# Altium project RA6M1_1.PrjPcb
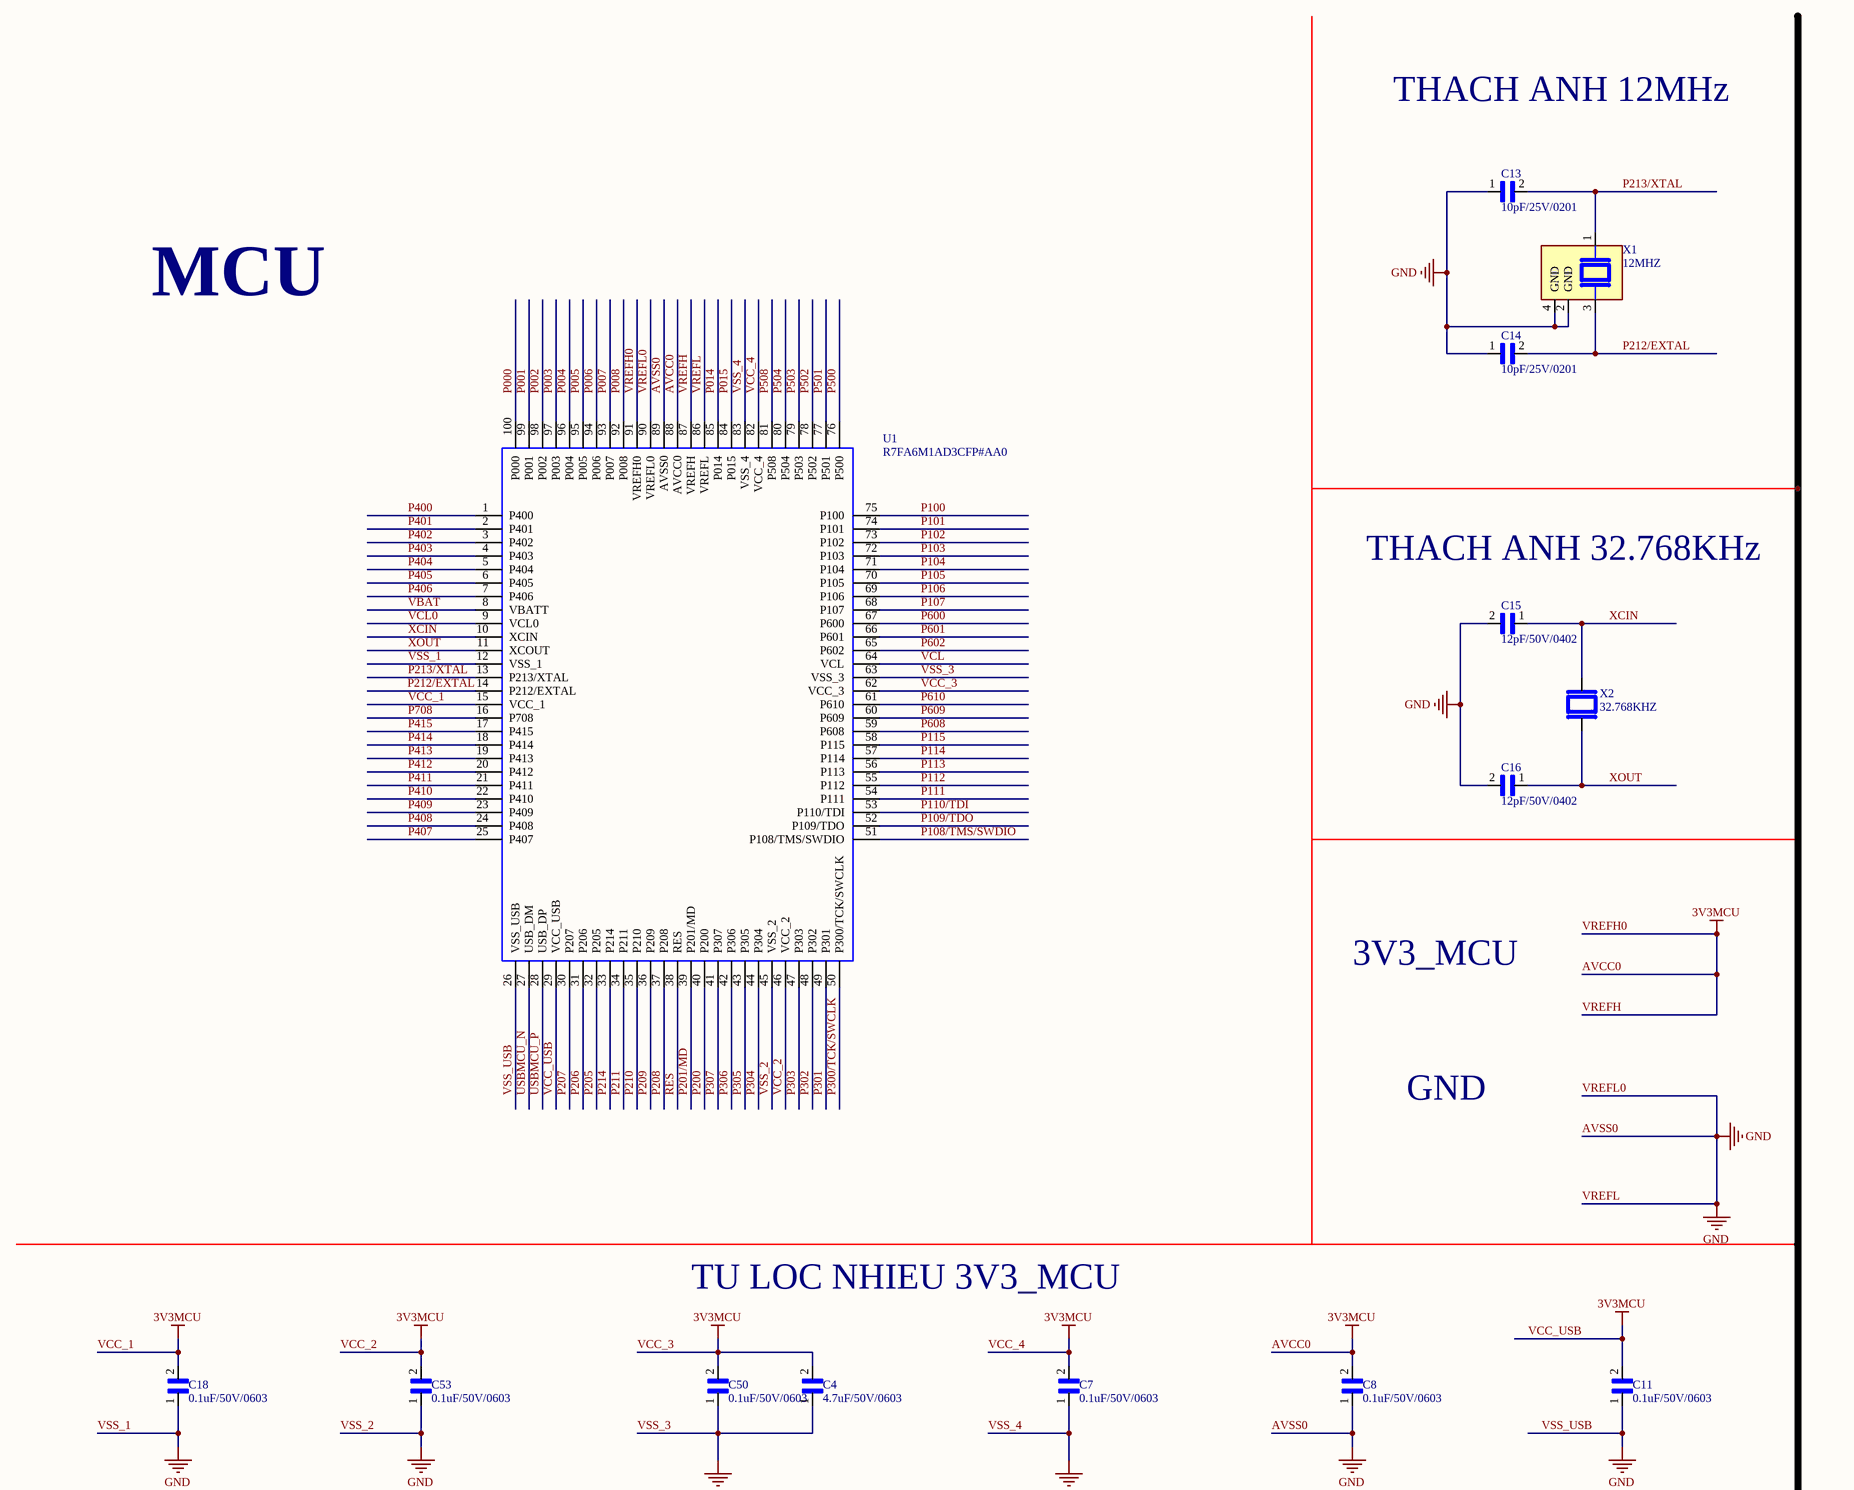
[diagram p0: RA6M1.SchDoc, top left]
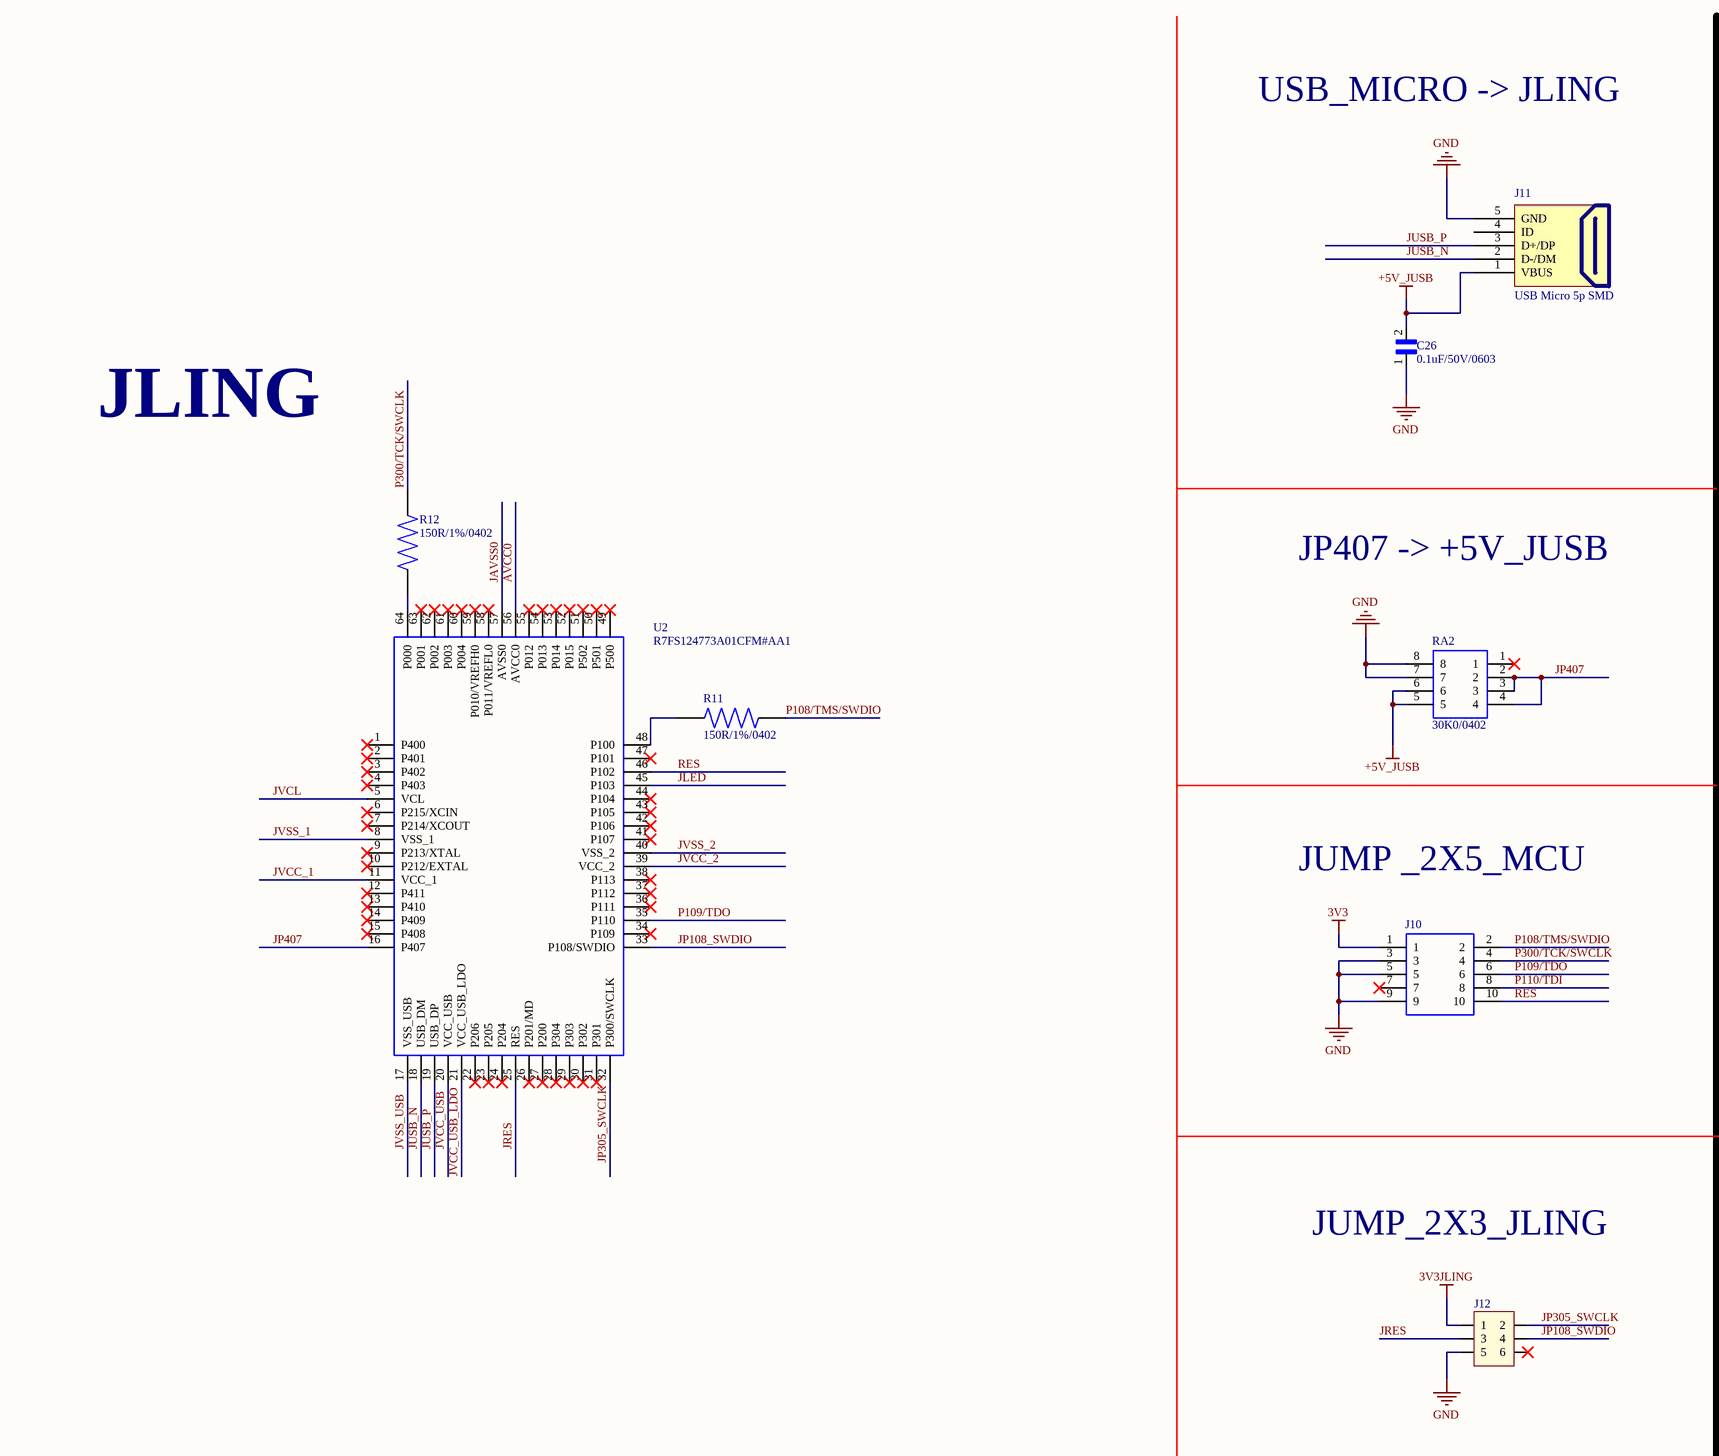
[diagram p1: RA6M1.SchDoc, top middle]
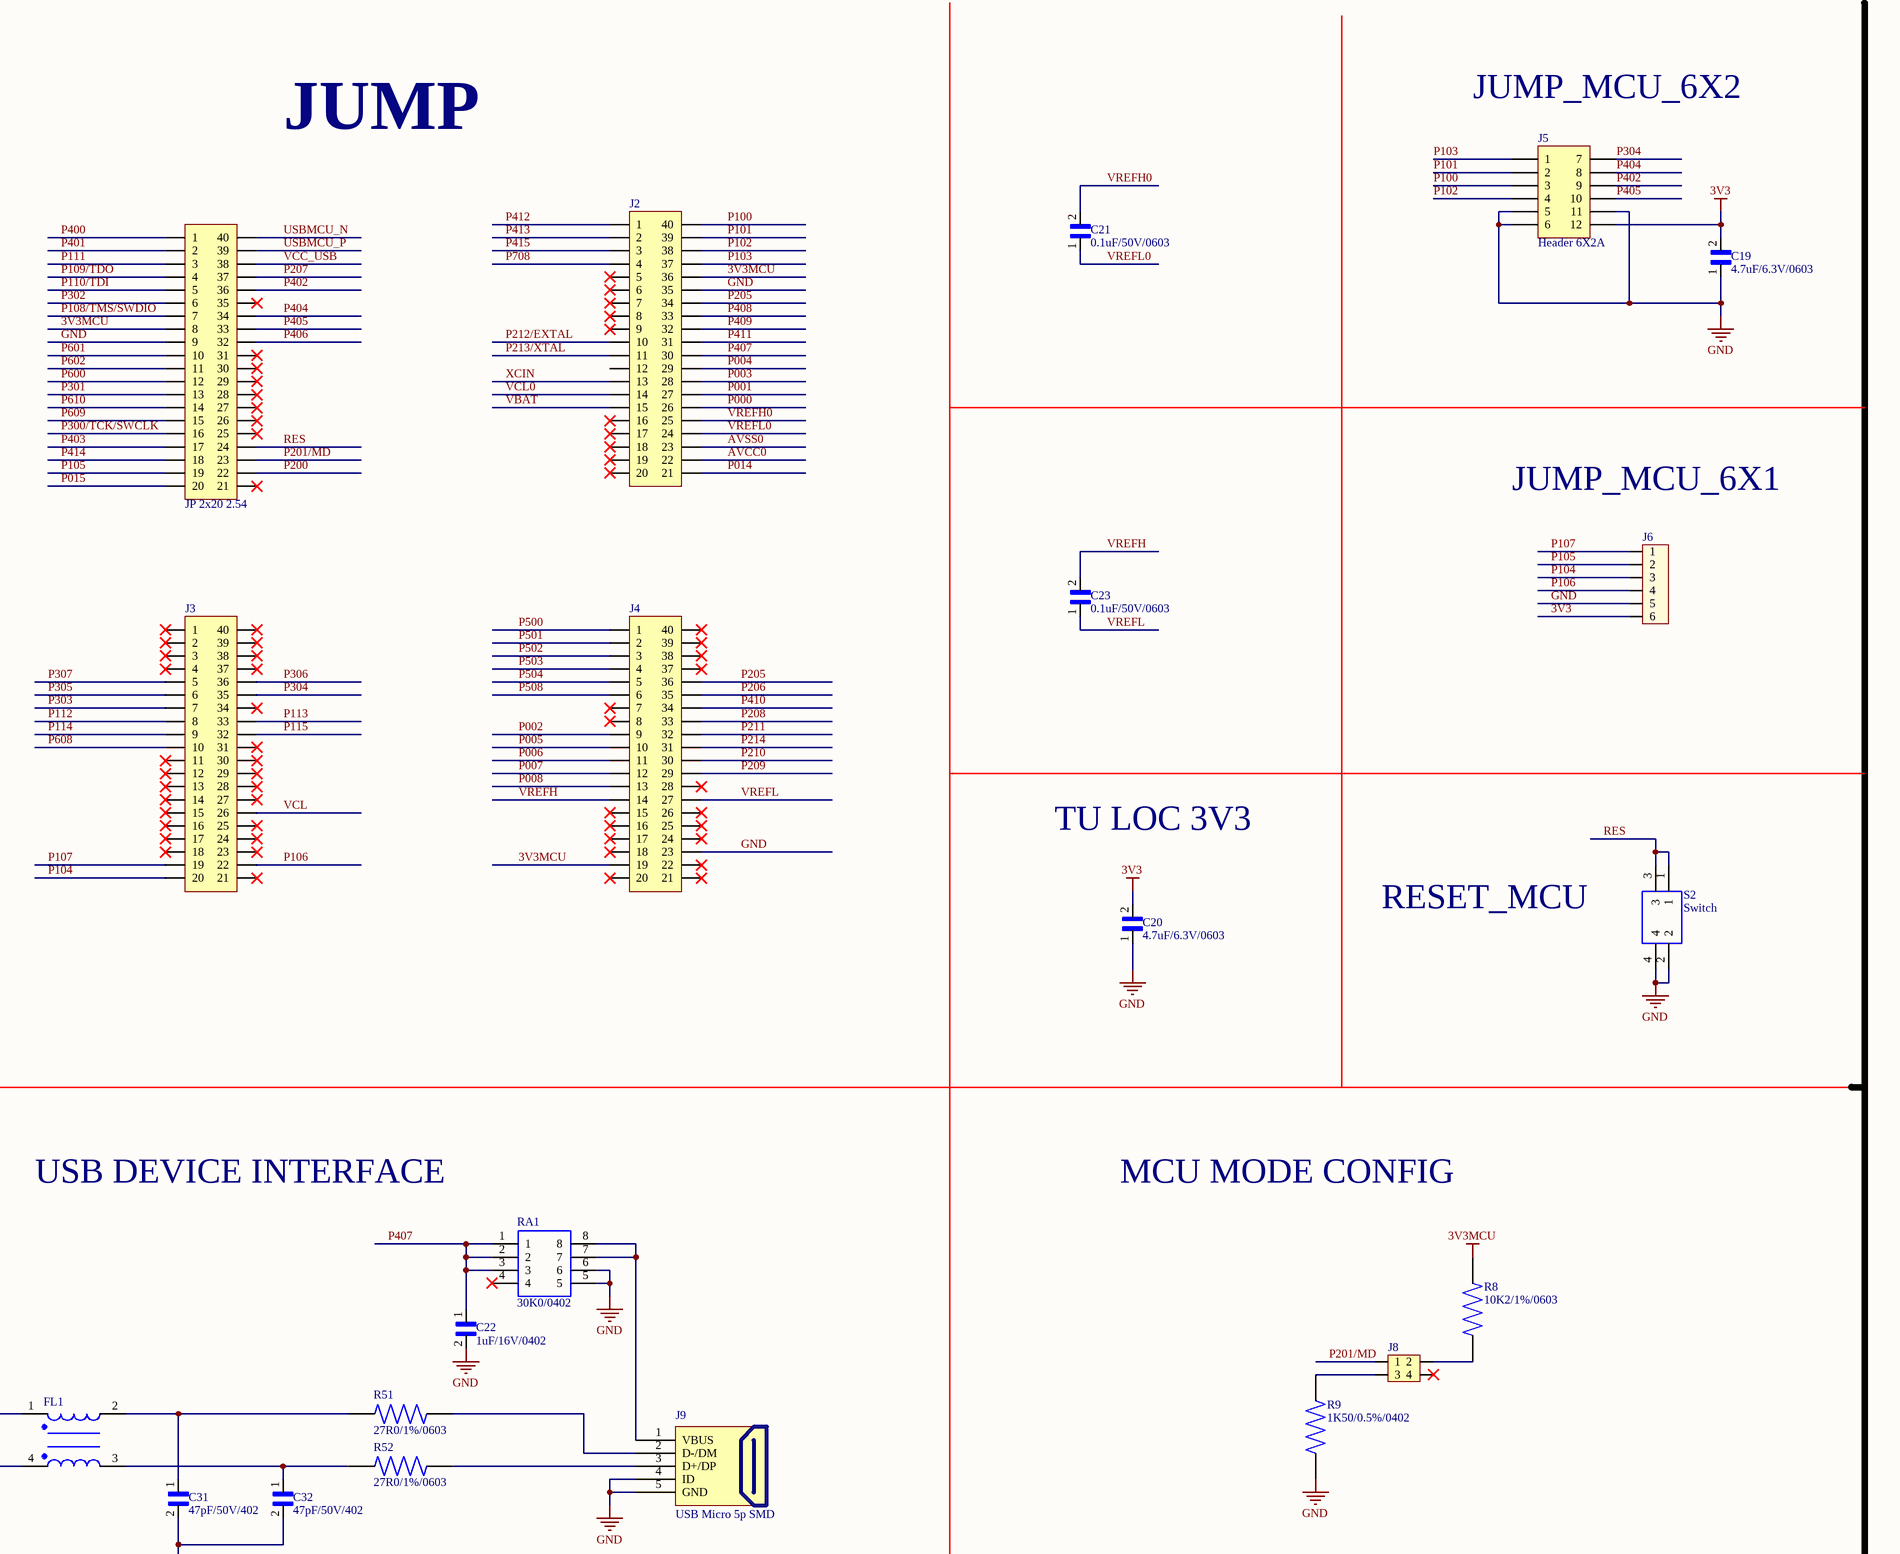
[diagram p2: RA6M1.SchDoc, top right]
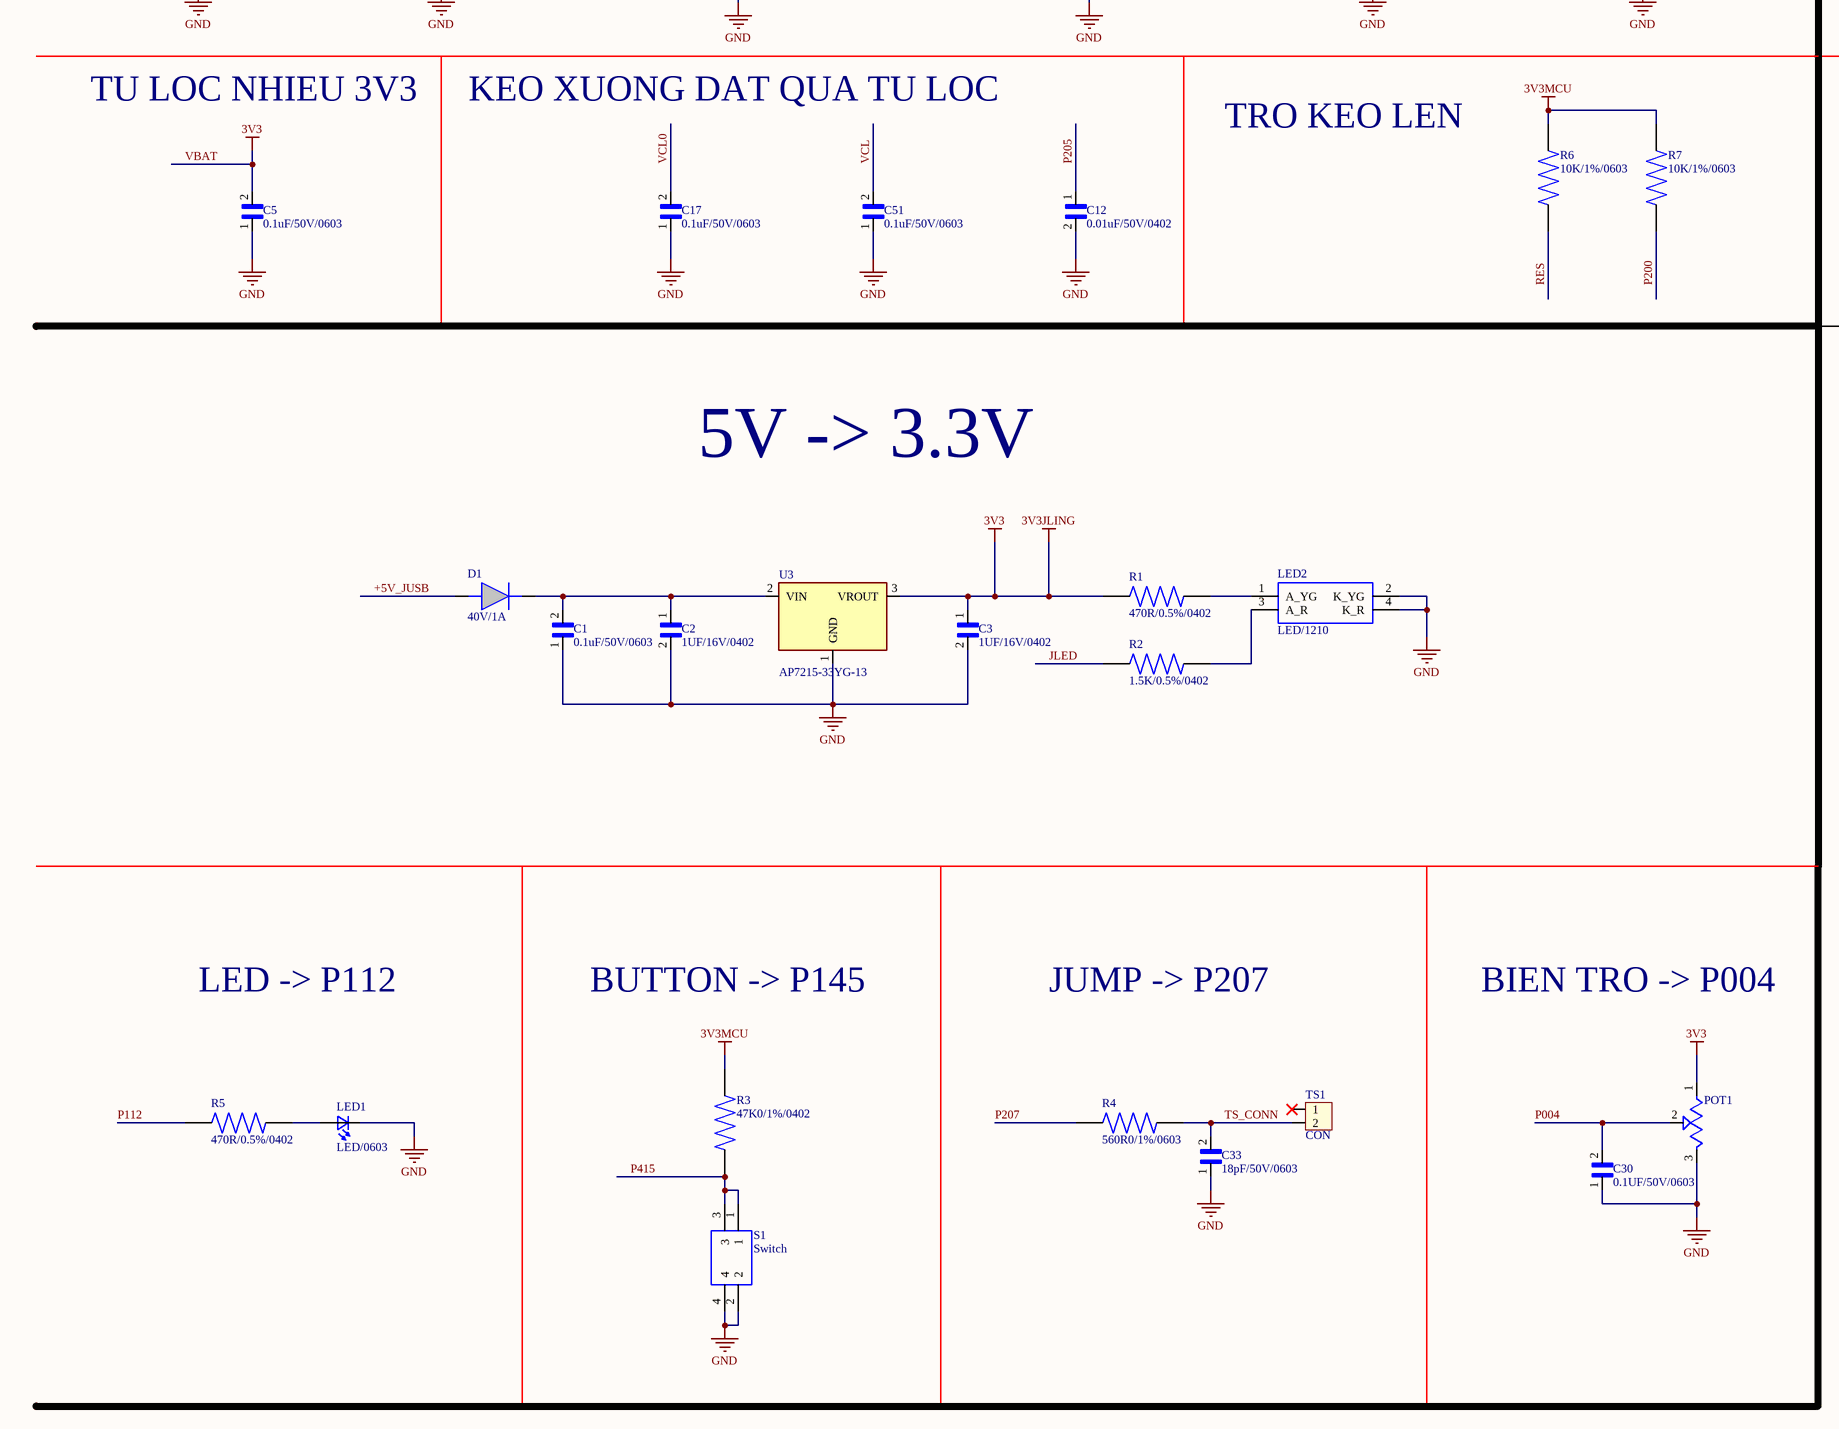
[diagram p3: RA6M1.SchDoc, bottom left]
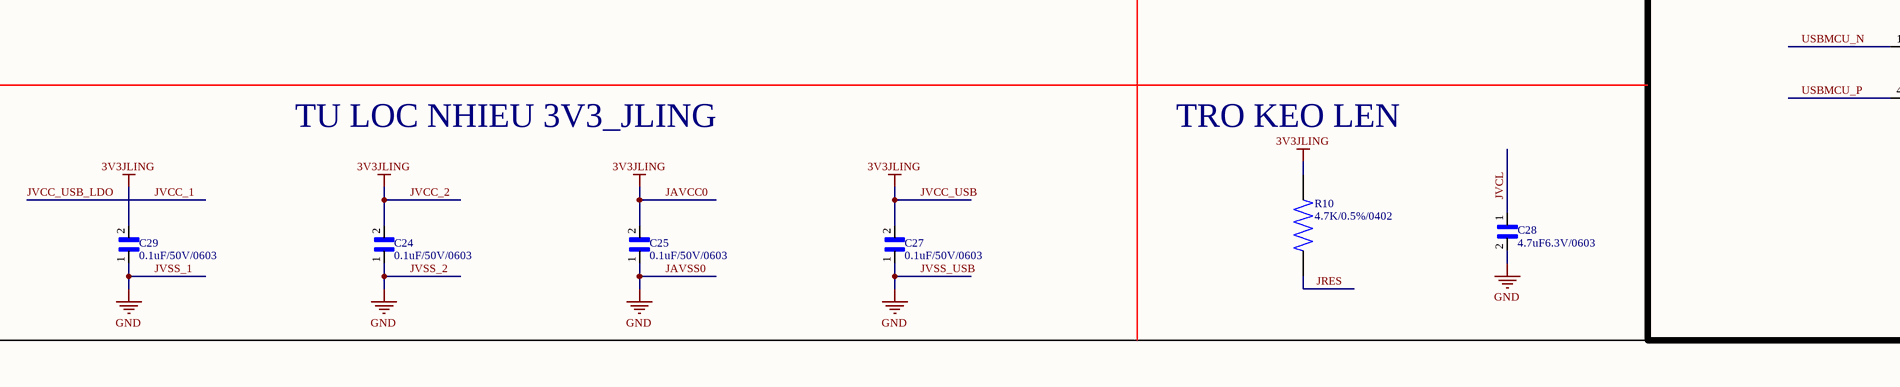
[diagram p4: RA6M1.SchDoc, bottom middle]
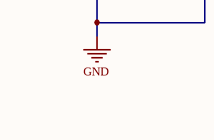
[diagram p5: RA6M1.SchDoc, bottom right]
1 sheet, 73 parts. Net scope: global (net labels, ports and power ports of the same name join across sheets).
Board file: RA6M1.PcbDoc

## Sheet RA6M1.SchDoc
size A0; SheetNumber: 1; SheetTotal: 1

### Parts
C1  0.1uF/50V/0603  [CAPC1608X90N]
C2  1UF/16V/0402  [CAPC1005X55N]
C3  1UF/16V/0402  [CAPC1005X55N]
C4  4.7uF/50V/0603  [CAPC1608X90N]
C5  0.1uF/50V/0603  [CAPC1608X90N]
C7  0.1uF/50V/0603  [CAPC1608X90N]
C8  0.1uF/50V/0603  [CAPC1608X90N]
C11  0.1uF/50V/0603  [CAPC1608X90N]
C12  0.01uF/50V/0402  [CAPC1005X55N]
C13  10pF/25V/0201  [RESC0603X26N]
C14  10pF/25V/0201  [RESC0603X26N]
C15  12pF/50V/0402  [CAPC1005X55N]
C16  12pF/50V/0402  [CAPC1005X55N]
C17  0.1uF/50V/0603  [CAPC1608X90N]
C18  0.1uF/50V/0603  [CAPC1608X90N]
C19  4.7uF/6.3V/0603  [CAPC1608X90N]
C20  4.7uF/6.3V/0603  [CAPC1608X90N]
C21  0.1uF/50V/0603  [CAPC1608X90N]
C22  1uF/16V/0402  [CAPC1005X55N]
C23  0.1uF/50V/0603  [CAPC1608X90N]
C24  0.1uF/50V/0603  [CAPC1608X90N]
C25  0.1uF/50V/0603  [CAPC1608X90N]
C26  0.1uF/50V/0603  [CAPC1608X90N]
C27  0.1uF/50V/0603  [CAPC1608X90N]
C28  4.7uF6.3V/0603  [CAPC1608X90N]
C29  0.1uF/50V/0603  [CAPC1608X90N]
C30  0.1UF/50V/0603  [CAPC1608X90N]
C31  47pF/50V/402  [CAPC1005X55N]
C32  47pF/50V/402  [CAPC1005X55N]
C33  18pF/50V/0603  [CAPC1608X90N]
C50  0.1uF/50V/0603  [CAPC1608X90N]
C51  0.1uF/50V/0603  [CAPC1608X90N]
C53  0.1uF/50V/0603  [CAPC1608X90N]
D1  40V/1A  [SODFL3616X98N]
FL1  DLP11SN201HL2L  [FIL_DLP11SN201HL2L]  (value not drawn)
J1  JP 2x20 2.54  [JP 2x20 DT]
J2  JP 2x20 2.54  [JP 2x20 DT]  (value not drawn)
J3  JP 2x20 2.54  [JP 2x20 DT]  (value not drawn)
J4  JP 2x20 2.54  [JP 2x20 DT]  (value not drawn)
J5  Header 6X2A  [HDR2X6_CEN]
J6  JP6  [jam6]  (value not drawn)
J8  JP2x2  [HDR2X2]  (value not drawn)
J9  USB Micro 5p SMD  [USB Micro 5p SMD]
J10  3220-10-0100-00  [322010010000]  (value not drawn)
J11  USB Micro 5p SMD  [USB Micro 5p SMD]
J12  HEAD 3x2  [HDR2X3]  (value not drawn)
LED1  LED/0603  [0603]
LED2  LED/1210  [LED_597-7701-507F]
POT1  10K0  [TRIM_3352T-1-103LF]  (value not drawn)
R1  470R/0.5%/0402  [RES_ERA2AED472X]
R2  1.5K/0.5%/0402  [RES_ERA2AED472X]
R3  47K0/1%/0402  [RES_ERA2AED472X]
R4  560R0/1%/0603  [RESC1508X55N]
R5  470R/0.5%/0402  [RES_ERA2AED472X]
R6  10K/1%/0603  [RESC1508X55N]
R7  10K/1%/0603  [RESC1508X55N]
R8  10K2/1%/0603  [RESC1508X55N]
R9  1K50/0.5%/0402  [RES_ERA2AED472X]
R10  4.7K/0.5%/0402  [RES_ERA2AED472X]
R11  150R/1%/0402  [RES_ERA2AED472X]
R12  150R/1%/0402  [RES_ERA2AED472X]
R51  27R0/1%/0603  [RESC1508X55N]
R52  27R0/1%/0603  [RESC1508X55N]
RA1  30K0/0402  [EXB28V510JX]
RA2  30K0/0402  [EXB28V510JX]
S1  Switch  [PTS645(SMT)]
S2  Switch  [PTS645(SMT)]
TS1  CON  [CON2]
U1  R7FA6M1AD3CFP#AA0  [QFP50P1600X1600X170-100N]
U2  R7FS124773A01CFM#AA1  [QFP50P1200X1200X170-64N]
U3  AP7215-33YG-13  [SOT150P400X160-3N]
X1  12MHZ  [XTAL_ABM8G-12.000MHZ-B4Y-T]
X2  32.768KHZ  [XTAL_ABS07-32.768KHZ-T]

### Nets
3V3: C3.1 C5.2 C19.2 C20.2 C24.2 C25.2 C27.2 C29.2 J2.15 J5.12 J6.6 J10.1 J12.1 POT1.1(CCW) R1.1 R10.2 U1.8(VBATT) U2.20(VCC_USB) U2.39(VCC_2) U3.3(VROUT)  [also labelled 3V3JLING, JAVCC0, JVCC_2, JVCC_USB, VBAT]
3V3MCU: C4.2 C7.2 C8.2 C11.2 C18.2 C21.2 C23.2 C50.2 C53.2 J1.8 J1.38 J2.22 J2.25 J2.36 J4.14 J4.19 R3.2 R6.2 R7.2 R8.2 U1.15(VCC_1) U1.29(VCC_USB) U1.46(VCC_2) U1.62(VCC_3) U1.82(VCC_4) U1.87(VREFH) U1.88(AVCC0) U1.91(VREFH0) U2.56(AVCC0)  [also labelled AVCC0, VCC_1, VCC_2, VCC_3, VCC_4, VCC_USB, VREFH, VREFH0]
+5V_JUSB: C26.2 D1.2(A) J11.1(VBUS) RA2.5 RA2.6
AVSS0: C1.1 C2.2 C3.2 C4.1 C5.1 C7.1 C8.1 C11.1 C12.2 C13.1 C14.1 C15.2 C16.2 C17.1 C18.1 C19.1 C20.1 C21.1 C22.2 C23.1 C24.1 C25.1 C26.1 C27.1 C28.2 C29.1 C30.1 C31.2 C32.2 C33.1 C50.1 C51.1 C53.1 J1.9 J2.23 J2.24 J2.35 J4.23 J4.27 J5.5 J5.6 J5.11 J6.5 J9.4(ID) J9.5(GND) J10.3 J10.5 J10.9 J11.5(GND) J12.5 LED1.1(K2) LED2.2(K_YG) LED2.4(K_R) POT1.3(CW) R9.1 RA1.5 RA1.6 RA2.7 RA2.8 S1.2 S1.4 S2.2 S2.4 U1.12(VSS_1) U1.26(VSS_USB) U1.45(VSS_2) U1.63(VSS_3) U1.83(VSS_4) U1.86(VREFL) U1.89(AVSS0) U1.90(VREFL0) U2.8(VSS_1) U2.17(VSS_USB) U2.40(VSS_2) U2.57(AVSS0) U3.1(GND) X1.2(GND) X1.4(GND)  [also labelled GND, JAVSS0, JVSS_1, JVSS_2, JVSS_USB, VREFL, VREFL0, VSS_1, VSS_2, VSS_3, VSS_4, VSS_USB]
JLED: R2.1 U2.45(P103)
JP108_SWDIO: J12.4 U2.33(P108/SWDIO)
JP305_SWCLK: J12.2 U2.32(P300/SWCLK)
JP407: RA2.2 RA2.3 RA2.4 U2.16(P407)
JRES: J12.3 R10.1 U2.25(RES)
JUSB_N: J11.2(D-/DM) U2.18(USB_DM)
JUSB_P: J11.3(D+/DP) U2.19(USB_DP)
JVCC_1: U2.11(VCC_1) U2.21(VCC_USB_LDO)  [also labelled JVCC_USB_LDO]
JVCL: C28.1 U2.5(VCL)
P000: J2.26 U1.100(P000)
P001: J2.27 U1.99(P001)
P002: J4.9 U1.98(P002)
P003: J2.28 U1.97(P003)
P004: C30.2 J2.29 POT1.2(WIPER) U1.96(P004)
P005: J4.10 U1.95(P005)
P006: J4.11 U1.94(P006)
P007: J4.12 U1.93(P007)
P008: J4.13 U1.92(P008)
P014: J2.21 U1.85(P014)
P015: J1.20 U1.84(P015)
P100: J2.40 J5.3 U1.75(P100)
P101: J2.39 J5.2 U1.74(P101)
P102: J2.38 J5.4 U1.73(P102)
P103: J2.37 J5.1 U1.72(P103)
P104: J3.20 J6.3 U1.71(P104)
P105: J1.19 J6.2 U1.70(P105)
P106: J3.22 J6.4 U1.69(P106)
P107: J3.19 J6.1 U1.68(P107)
P108/TMS/SWDIO: J1.7 J10.2 R11.2 U1.51(P108/TMS/SWDIO)
P109/TDO: J1.4 J10.6 U1.52(P109/TDO) U2.35(P110)
P110/TDI: J1.5 J10.8 U1.53(P110/TDI)
P111: J1.3 U1.54(P111)
P112: J3.8 R5.1 U1.55(P112)
P113: J3.33 U1.56(P113)
P114: J3.9 U1.57(P114)
P115: J3.32 U1.58(P115)
P200: J1.22 R7.1 U1.40(P200)
P201/MD: J1.23 J8.1 U1.39(P201/MD)
P205: C12.1 J2.34 J4.36 U1.32(P205)
P206: J4.35 U1.31(P206)
P207: J1.37 R4.1 U1.30(P207)
P208: J4.33 U1.37(P208)
P209: J4.29 U1.36(P209)
P210: J4.30 U1.35(P210)
P211: J4.32 U1.34(P211)
P212/EXTAL: C14.2 J2.10 U1.14(P212/EXTAL) X1.3
P213/XTAL: C13.2 J2.11 U1.13(P213/XTAL) X1.1
P214: J4.31 U1.33(P214)
P300/TCK/SWCLK: J1.16 J10.4 R12.1 U1.50(P300/TCK/SWCLK)
P301: J1.13 U1.49(P301)
P302: J1.6 U1.48(P302)
P303: J3.7 U1.47(P303)
P304: J3.35 J5.7 U1.44(P304)
P305: J3.6 U1.43(P305)
P306: J3.36 U1.42(P306)
P307: J3.5 U1.41(P307)
P400: J1.1 U1.1(P400)
P401: J1.2 U1.2(P401)
P402: J1.36 J5.9 U1.3(P402)
P403: J1.17 U1.4(P403)
P404: J1.34 J5.8 U1.5(P404)
P405: J1.33 J5.10 U1.6(P405)
P406: J1.32 U1.7(P406)
P407: C22.1 J2.30 RA1.1 RA1.2 RA1.3 U1.25(P407)
P408: J2.33 U1.24(P408)
P409: J2.32 U1.23(P409)
P410: J4.34 U1.22(P410)
P411: J2.31 U1.21(P411)
P412: J2.1 U1.20(P412)
P413: J2.2 U1.19(P413)
P414: J1.18 U1.18(P414)
P415: J2.3 R3.1 S1.1 S1.3 U1.17(P415)
P500: J4.1 U1.76(P500)
P501: J4.2 U1.77(P501)
P502: J4.3 U1.78(P502)
P503: J4.4 U1.79(P503)
P504: J4.5 U1.80(P504)
P508: J4.6 U1.81(P508)
P600: J1.12 U1.67(P600)
P601: J1.10 U1.66(P601)
P602: J1.11 U1.65(P602)
P608: J3.10 U1.59(P608)
P609: J1.15 U1.60(P609)
P610: J1.14 U1.61(P610)
P708: J2.4 U1.16(P708)
RES: J1.24 J10.10 R6.1 S2.1 S2.3 U1.38(RES) U2.46(P102)
TS_CONN: C33.2 R4.2 TS1.2
USBMCU_N: FL1.1 J1.40 U1.27(USB_DM)
USBMCU_P: FL1.4 J1.39 U1.28(USB_DP)
VCL: C51.2 J3.26 U1.64(VCL)
VCL0: C17.2 J2.14 U1.9(VCL0)
XCIN: C15.1 J2.13 U1.10(XCIN) X2.1
XOUT: C16.1 U1.11(XCOUT) X2.2
NetC1_2: C1.2 C2.1 D1.1(K) U3.2(VIN)
NetC31_1: C31.1 FL1.2 R51.1
NetC32_1: C32.1 FL1.3 R52.1
NetJ8_2: J8.2 R8.1
NetJ8_3: J8.3 R9.2
NetJ9_1: J9.1(VBUS) RA1.7 RA1.8
NetJ9_2: J9.2(D-/DM) R51.2
NetJ9_3: J9.3(D+/DP) R52.2
NetLED1_2: LED1.2(A2) R5.2
NetLED2_1: LED2.1(A_YG) R1.2
NetLED2_3: LED2.3(A_R) R2.2
NetR11_1: R11.1 U2.48(P100)
NetR12_2: R12.2 U2.64(P000)

Not connected (* = marked no-connect by the designer): J1 21* 25* 26* 27* 28* 29* 30* 31* 35*; J2 5* 6* 7* 8* 9* 12 16* 17* 18* 19* 20*; J3 1* 2* 3* 4* 11* 12* 13* 14* 15* 16* 17* 18* 21* 23* 24* 25* 27* 28* 29* 30* 31* 34* 37* 38* 39* 40*; J4 7* 8* 15* 16* 17* 18* 20* 21* 22* 24* 25* 26* 28* 37* 38* 39* 40*; J8 4*; J10 7*; J11 4(ID); J12 6*; RA1 4*; RA2 1*; TS1 1*; U2 1(P400)* 2(P401)* 3(P402)* 4(P403)* 6(P215/XCIN)* 7(P214/XCOUT)* 9(P213/XTAL)* 10(P212/EXTAL)* 12(P411)* 13(P410)* 14(P409)* 15(P408)* 22(P206)* 23(P205)* 24(P204)* 26(P201/MD)* 27(P200)* 28(P304)* 29(P303)* 30(P302)* 31(P301)* 34(P109)* 36(P111)* 37(P112)* 38(P113)* 41(P107)* 42(P106)* 43(P105)* 44(P104)* 47(P101)* 49(P500)* 50(P501)* 51(P502)* 52(P015)* 53(P014)* 54(P013)* 55(P012)* 58(P011/VREFL0)* 59(P010/VREFH0)* 60(P004)* 61(P003)* 62(P002)* 63(P001)*

### Notes on the sheet
- THACH ANH 12MHz
- USB_MICRO -> JLING
- JUMP_MCU_6X2
- JUMP
- MCU
- JLING
- JUMP_MCU_6X1
- THACH ANH 32.768KHz
- JP407 -> +5V_JUSB
- JUMP _2X5_MCU
- TU LOC 3V3
- 3V3_MCU
- RESET_MCU
- GND
- JUMP_2X3_JLING
- USB DEVICE INTERFACE
- MCU MODE CONFIG
- TU LOC NHIEU 3V3_MCU
- TU LOC NHIEU 3V3
- KEO XUONG DAT QUA TU LOC
- TRO KEO LEN
- TU LOC NHIEU 3V3_JLING
- 5V -> 3.3V
- LED -> P112
- BUTTON -> P145
- JUMP -> P207
- BIEN TRO -> P004

### Library data of the parts
C1 C4 C5 C7 C8 C11 C17-C21 C23-C30 C33 C50 C51 C53 = CL10B104KB8NNNC: 0.1ÂµF Â±10% 50V Ceramic Capacitor X7R 0603 _1608 Metric_; MF: Samsung Electro-Mechanics; Price: None; MP: CL10B104KB8NNNC; SnapEDA_Link: https://www.snapeda.com/parts/CL10B104KB8NNNC/Samsung%20Electro-Mechanics/view-part/3598309/?ref=snap; Availability: Unavailable; Package: 0603 Samsung; Value: *
C2 C3 C12 C15 C16 C22 C31 C32 = CL05A105KO5NNNC: 1ÂµF Â±10% 16V Ceramic Capacitor X5R 0402 (1005 Metric); MF: Samsung Electro-Mechanics; Purchase-URL: https://pricing.snapeda.com/search/part/CL05A105KO5NNNC/?ref=eda; SnapEDA_Link: https://www.snapeda.com/parts/CL05A105KO5NNNC/Samsung%20Electro-Mechanics/view-part/3598151/?ref=snap; Availability: Good; Price: None; MP: CL05A105KO5NNNC; Check_prices: https://www.snapeda.com/parts/CL05A105KO5NNNC/Samsung%20Electro-Mechanics/view-part/3598151/?ref=eda; Package: 0402 Samsung; Value: *
C13 C14 = RESC0603X26N: TU0201; MP: CL10B104KB8NNNC; MF: Samsung Electro-Mechanics; Price: None; SnapEDA_Link: https://www.snapeda.com/parts/CL10B104KB8NNNC/Samsung%20Electro-Mechanics/view-part/3598309/?ref=snap; Availability: Unavailable; Package: 0603 Samsung; Value: *
D1 = MBR140SFT1G: Diode Schottky 40V 1A SOD-123FL ON Semiconductor MBR140SFT1G Schottky Diode, 1A, 40V, 2-Pin SOD-123FL; Manufacturer_Name: onsemi; Geometry.Height: 0.98mm; Manufacturer_Part_Number: MBR140SFT1G; Mouser Part Number: 863-MBR140SFT1G; Mouser Price/Stock: https://www.mouser.co.uk/ProductDetail/onsemi/MBR140SFT1G?qs=3JMERSakebrc0eIUjXPasA%3D%3D; Arrow Part Number: MBR140SFT1G; Arrow Price/Stock: https://www.arrow.com/en/products/mbr140sft1g/on-semiconductor?region=nac; Mouser Testing Part Number: *; Mouser Testing Price/Stock: *; Datasheet Link: http://www.onsemi.com/pub/Collateral/MBR140SFT1-D.PDF
FL1 = DLP11SN201HL2L: 2 Line Common Mode Choke Surface Mount 200 Ohms @ 100MHz 110mA DCR 3.88Ohm; MF: Murata; DigiKey-Purchase-URL: https://snapeda.com/shop?store=DigiKey&id=4300877; SnapEDA_Link: https://www.snapeda.com/parts/DLP11SN201HL2L/Murata/view-part/4300877/?ref=snap; MP: DLP11SN201HL2L; Availability: Unavailable; Price: None; Value: *; Package: 1210 Murata
J1-J4 = JP 2x20 2.54 Duc Thang: Cắm; Ten_Linh_Kien: Jump Đôi Đực 2.54MM 2x40P Thẳng 11MM; Don_Vi: Con; Ma_Hang: MH002686; Ghi_Chu: *; Kieu_Chan: *; Chung_Loai: Cắm
J5 = Header 6X2A: Header, 6-Pin, Dual row; LatestRevisionDate: 17-Jul-2002; LatestRevisionNote: Re-released for DXP Platform.; Publisher: Altium Limited
J6 = jam 6: Value: Connector 6
J9 J11 = USB Micro 5p SMD: USB Type B; Ten: MicroUSB MK5P SMD; Ma_Hang: MH001020
J10 = 3220-10-0100-00: Conn Shrouded Header (4 Sides) HDR 10 POS 1.27mm Solder ST Thru-Hole; Manufacturer_Name: CNC Tech; Geometry.Height: 5.6mm; Manufacturer_Part_Number: 3220-10-0100-00; Mouser Part Number: *; Mouser Price/Stock: *; Arrow Part Number: 3220-10-0100-00; Arrow Price/Stock: https://www.arrow.com/en/products/3220-10-0100-00/cnc-tech-llc?region=nac; Mouser Testing Part Number: *; Mouser Testing Price/Stock: *; Datasheet Link: https://datasheet.datasheetarchive.com/originals/dk/DKDS-7/133059.pdf
J12 = JP3x2: Connector 3x2; Value: Connector 3x2
LED1 = LTST-C191KRKT: http://octopart.com/ltst-c190krkt-lite-on-549893; Package: None; MP: LTST-C191KRKT; Value: *; Availability: Unavailable; Price: None
LED2 = 598-8610-207F: Standard LEDs - SMD Red/Green WC 80/50mcd 645/570nm; Manufacturer_Name: Dialight; Geometry.Height: 0.8mm; Manufacturer_Part_Number: 598-8610-207F; Mouser Part Number: 645-598-8610-207F; Mouser Price/Stock: https://www.mouser.co.uk/ProductDetail/Dialight/598-8610-207F?qs=7JStj%2FjQ2SFuCjosqwklHQ%3D%3D; Arrow Part Number: 598-8610-207F; Arrow Price/Stock: https://www.arrow.com/en/products/598-8610-207f/dialight?region=nac; Mouser Testing Part Number: *; Mouser Testing Price/Stock: *; Datasheet Link: https://media.digikey.com/pdf/Data%20Sheets/Dialight%20PDFs/598%20Series%201210%20Pkg%20Bi-Color.pdf
POT1 = 3352T-1-103LF: 10 kOhms 0.5W, 1/2W Through Hole Thumbwheel Potentiometer Top Adjustment; MF: Bourns; Package: 3352T-3 Bourns; MP: 3352T-1-103LF; Availability: In Stock; SnapEDA_Link: https://www.snapeda.com/parts/3352T-1-103LF/Bourns/view-part/?ref=snap; Price: None; Check_prices: https://www.snapeda.com/parts/3352T-1-103LF/Bourns/view-part/?ref=eda; Value: *; Purchase-URL: https://pricing.snapeda.com/search/part/3352T-1-103LF/?ref=eda
R1-R3 R5 R9-R12 = ERA2AED472X: Res Thin Film 0402 4.7K Ohm 0.5% 0.063W(1/16W) 25ppm/C Molded SMD Automotive Punched T/R; MF: Panasonic Electronic; MP: ERA-2AED472X; Package: 1005-2 Panasonic; Purchase-URL: https://pricing.snapeda.com/search/part/ERA-2AED472X/?ref=eda; Value: *; Check_prices: https://www.snapeda.com/parts/ERA-2AED472X/Panasonic+Electronic+Components/view-part/?ref=eda; Price: None; Availability: In Stock; SnapEDA_Link: https://www.snapeda.com/parts/ERA-2AED472X/Panasonic+Electronic+Components/view-part/?ref=snap
R4 R6-R8 R51 R52 = RMCF0603JT27R0: Package: None; Price: None; Value: *; MP: RMCF0603JT27R0; Availability: Unavailable
RA1 RA2 = EXB28V303JX: Resistor Networks & Arrays Resistor ArrayChip 0804 4 elements; Manufacturer_Name: Panasonic; Geometry.Height: 0mm; Manufacturer_Part_Number: EXB28V303JX; Mouser Part Number: *; Mouser Price/Stock: *; Arrow Part Number: *; Arrow Price/Stock: *; Mouser Testing Part Number: *; Mouser Testing Price/Stock: *; Datasheet Link: https://industrial.panasonic.com/cdbs/www-data/pdf/AOC0000/AOC0000C14.pdf
S1 S2 = PTS645SM43SMTR92LFS: C & K COMPONENTS - PTS645SM43SMTR92LFS - SWITCH, SPST, 0.05A, 12VDC, SMD, 4.3MM; Manufacturer_Name: C & K COMPONENTS; Manufacturer_Part_Number: PTS645SM43SMTR92LFS; Mouser Part Number: 611-PTS645SM43SMTR92; Mouser Price/Stock: https://www.mouser.co.uk/ProductDetail/CK/PTS645SM43SMTR92LFS?qs=FESYatJ8odKPktxv6ncfWg%3D%3D; Arrow Part Number: PTS645SM43SMTR92LFS; Arrow Price/Stock: https://www.arrow.com/en/products/pts645sm43smtr92lfs/ck; Mouser Testing Part Number: *; Mouser Testing Price/Stock: *; Datasheet Link: http://www.farnell.com/datasheets/1914518.pdf
TS1 = Con2: connector 2
U1 = R7FA6M1AD3CFP#AA0: ARM Cortex-M4 RA6M1 Microcontroller IC 32-Bit 120MHz 512KB (512K x 8) FLASH 100-LFQFP (14x14); Manufacturer_Name: Renesas Electronics; Geometry.Height: 1.7mm; Manufacturer_Part_Number: R7FA6M1AD3CFP#AA0; Mouser Part Number: 968-7FA6M1AD3CFP#AA0; Mouser Price/Stock: https://www.mouser.co.uk/ProductDetail/Renesas-Electronics/R7FA6M1AD3CFPAA0?qs=d0WKAl%252BL4KaRUVVllxsS6w%3D%3D; Arrow Part Number: *; Arrow Price/Stock: *; Mouser Testing Part Number: *; Mouser Testing Price/Stock: *; Datasheet Link: https://www.renesas.com/in/en/document/dst/renesas-ra6m1-group-datasheet
U2 = R7FS124773A01CFM#AA1: S124; Manufacturer_Name: Renesas Electronics; Geometry.Height: 1.7mm; Manufacturer_Part_Number: R7FS124773A01CFM#AA1; Mouser Part Number: 968-124773A01CFM#AA1; Mouser Price/Stock: https://www.mouser.co.uk/ProductDetail/Renesas-Electronics/R7FS124773A01CFMAA1?qs=wUXugUrL1qwGPed2E2%2FoEA%3D%3D; Arrow Part Number: *; Arrow Price/Stock: *; Mouser Testing Part Number: *; Mouser Testing Price/Stock: *; Datasheet Link: https://www.renesas.com/en-us/doc/products/renesas-synergy/doc/r01ds0264eu0130-synergy-s124.pdf
U3 = AP7215-33YG-13: Linear Voltage Regulator IC 1 Output 600mA SOT-89-3; MF: Diodes Inc.; MP: AP7215-33YG-13; Value: *; SnapEDA_Link: https://www.snapeda.com/parts/AP7215-33YG-13/Diodes%20Inc./view-part/269921/?ref=snap; Package: SOT-89-3 Diodes Inc.; Availability: Unavailable; Price: None
X1 = ABM8G-12.000MHZ-B4Y-T: 12 MHz Â±30ppm Crystal 10pF 120 Ohms 4-SMD, No Lead; MF: Abracon; Purchase-URL: https://pricing.snapeda.com/search/part/ABM8G-12.000MHZ-B4Y-T/?ref=eda; SnapEDA_Link: https://www.snapeda.com/parts/ABM8G-12.000MHZ-B4Y-T/Abracon+LLC/view-part/?ref=snap; Price: None; Check_prices: https://www.snapeda.com/parts/ABM8G-12.000MHZ-B4Y-T/Abracon+LLC/view-part/?ref=eda; MP: ABM8G-12.000MHZ-B4Y-T; Value: *; Availability: In Stock; Package: SMD-4 Abracon
X2 = ABS07-32.768KHZ-T: 32.768 kHz Â±20ppm Crystal 12.5pF 70 kOhms 2-SMD, No Lead; MF: Abracon; Availability: In Stock; SnapEDA_Link: https://www.snapeda.com/parts/ABS07-32.768KHZ-T/Abracon+LLC/view-part/?ref=snap; MP: ABS07-32.768KHZ-T; Price: None; Value: *; Check_prices: https://www.snapeda.com/parts/ABS07-32.768KHZ-T/Abracon+LLC/view-part/?ref=eda; Purchase-URL: https://pricing.snapeda.com/search/part/ABS07-32.768KHZ-T/?ref=eda; Package: SMD-2 Abracon LLC